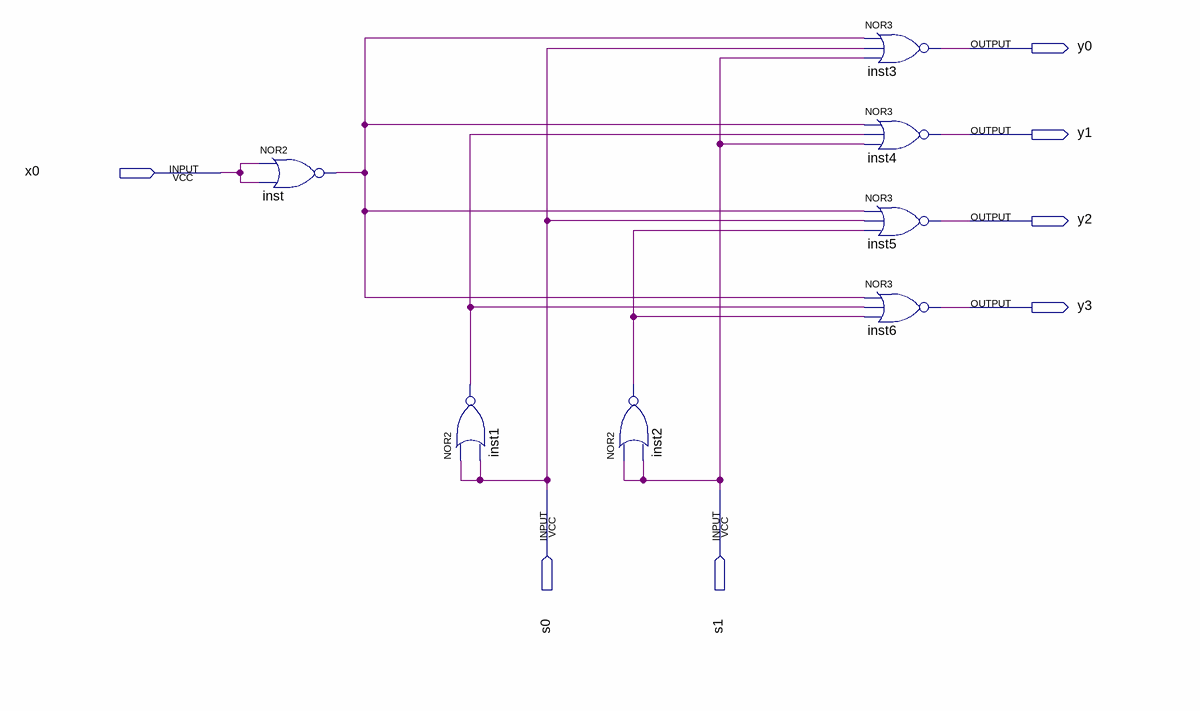
[diagram p0: schematic sheet]
// Quartus schematic Problema1.bdf as structural Verilog: 7 symbols, 7 pins
module Problema1 (
  input  x0,
  input  s0,
  input  s1,
  output y0,
  output y1,
  output y2,
  output y3
);

  wire inst1_out, inst2_out, inst_out;

  nor inst (inst_out, x0, x0);
  nor inst1 (inst1_out, s0, s0);
  nor inst2 (inst2_out, s1, s1);
  nor inst3 (y0, inst_out, s0, s1);
  nor inst4 (y1, inst_out, inst1_out, s1);
  nor inst5 (y2, inst_out, s0, inst2_out);
  nor inst6 (y3, inst_out, inst1_out, inst2_out);
endmodule
